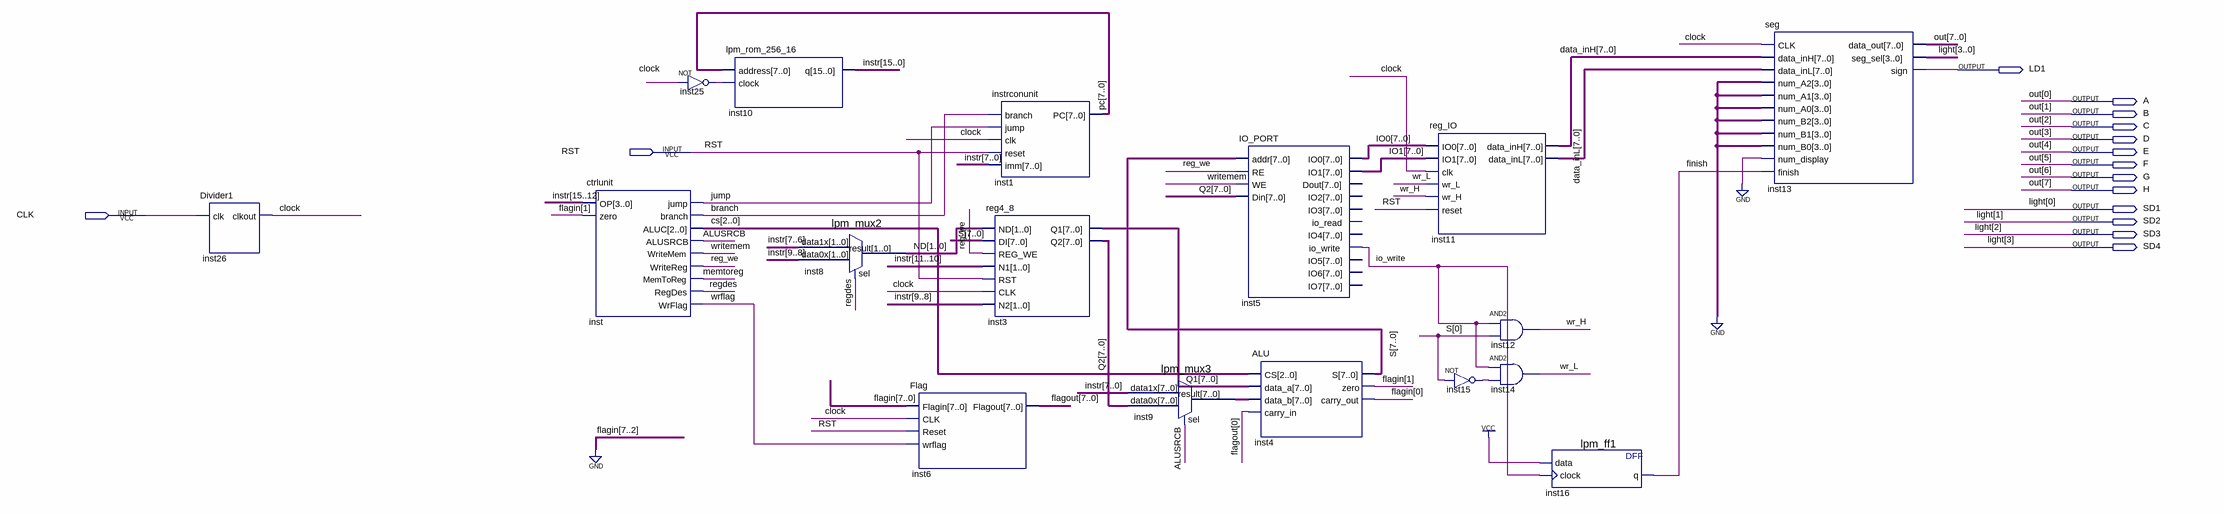
[diagram p0: schematic sheet]
// Quartus schematic systemB1.bdf as structural Verilog: 17 symbols, 15 pins
module systemB1 (
  input  RST,
  input  CLK,
  output LD1,
  output A,
  output B,
  output C,
  output D,
  output E,
  output F,
  output G,
  output H,
  output SD1,
  output SD2,
  output SD3,
  output SD4
);

  wire ALUSRCB, branch, clock, finish, inst15_out, inst25_out, io_write, jump, memtoreg, reg_we, regdes,
       wr_H, wr_L, wrflag, writemem;
  wire [1:0] flagin, ND;
  wire [2:0] cs;
  wire [7:0] data_inH, data_inL, flagout, inst9_result, IO0, IO1, pc, Q1, Q2, S;
  wire [15:0] instr;

  Divider1 inst26 (.clk(CLK), .clkout(clock));
  ctrlunit inst (
    .OP(instr[15:12]), .zero(flagin[1]), .jump(jump), .branch(branch), .ALUC(cs), .ALUSRCB(ALUSRCB),
    .WriteMem(writemem), .WriteReg(reg_we), .MemToReg(memtoreg), .RegDes(regdes), .WrFlag(wrflag));
  not inst25 (inst25_out, clock);
  lpm_rom_256_16 inst10 (.address(pc), .clock(inst25_out), .q(instr));
  lpm_mux2 inst8 (.data1x(instr[7:6]), .data0x(instr[9:8]), .sel(regdes), .result(ND));
  Flag inst6 (.Flagin({{6{1'b0}}, flagin}), .CLK(clock), .Reset(RST), .wrflag(wrflag), .Flagout(flagout));
  instrconunit inst1 (.branch(branch), .jump(jump), .clk(clock), .reset(RST), .imm(instr[7:0]), .PC(pc));
  reg4_8 inst3 (
    .ND(ND), .DI(S), .REG_WE(reg_we), .N1(instr[11:10]), .RST(RST), .CLK(clock), .N2(instr[9:8]), .Q1(Q1),
    .Q2(Q2));
  lpm_mux3 inst9 (.data1x(instr[7:0]), .data0x(Q2), .sel(ALUSRCB), .result(inst9_result));
  IO_PORT inst5 (
    .addr(S), .RE(reg_we), .WE(writemem), .Din(Q2), .io_write(io_write), .IO0(IO0), .IO1(IO1));  // open: Dout, io_read, IO2, IO3, IO4, IO5, IO6, IO7
  ALU inst4 (
    .CS(cs), .data_a(Q1), .data_b(inst9_result), .carry_in(flagout[0]), .S(S), .zero(flagin[1]),
    .carry_out(flagin[0]));
  reg_IO inst11 (
    .IO0(IO0), .IO1(IO1), .clk(clock), .wr_L(wr_L), .wr_H(wr_H), .reset(RST), .data_inH(data_inH),
    .data_inL(data_inL));
  not inst15 (inst15_out, S[0]);
  and inst12 (wr_H, io_write, S[0]);
  and inst14 (wr_L, io_write, inst15_out);
  lpm_ff1 inst16 (.data(1'b1), .clock(io_write), .q(finish));
  seg inst13 (
    .CLK(clock), .data_inH(data_inH), .data_inL(data_inL), .num_A2(4'b0000), .num_A1(4'b0000),
    .num_A0(4'b0000), .num_B2(4'b0000), .num_B1(4'b0000), .num_B0(4'b0000), .num_display(1'b0),
    .finish(finish), .data_out({H, G, F, E, D, C, B, A}), .seg_sel({SD4, SD3, SD2, SD1}), .sign(LD1));

  // Other names for the same wires on the sheet: light[3:0] = {SD4, SD3, SD2, SD1};
  //   out[7:0] = {H, G, F, E, D, C, B, A}
endmodule
